# EasyEDA schematic SCH_leanRA_2024-04-03.json
TITLE: Eletrônica Projeto Lean Realidade Aumentada; REV: 1.0; Date: 2023-11-07; Sheet: 1/1; Drawn By: renatobs; Company: SENAI Uberaba
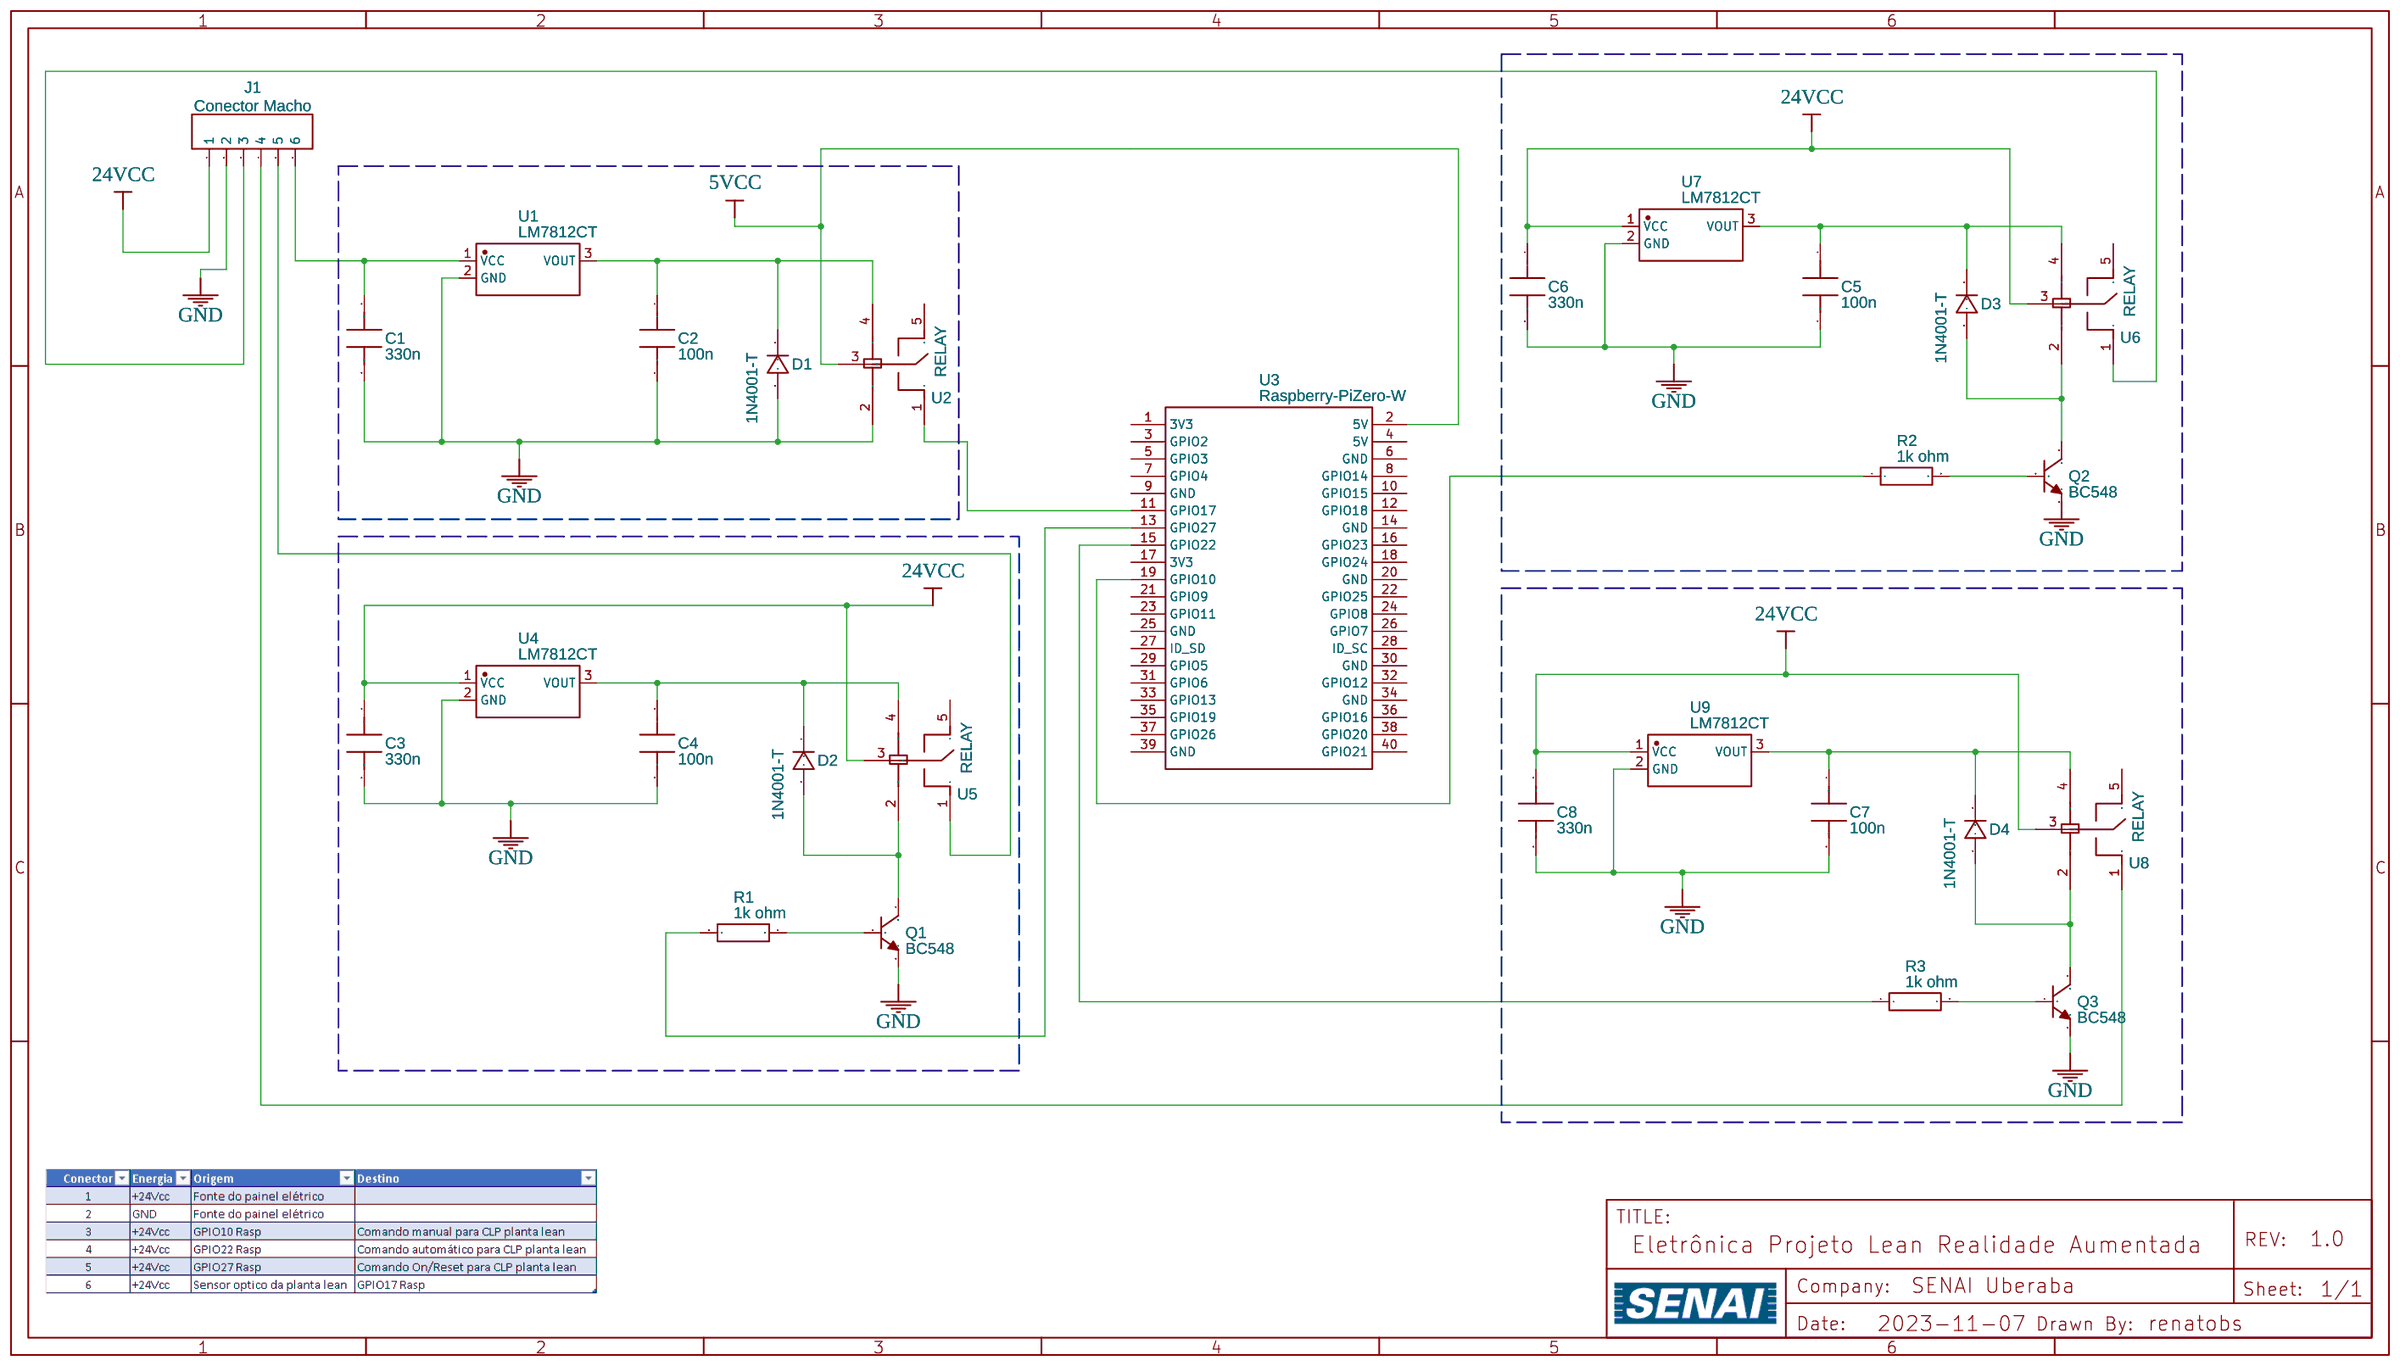
[diagram p0: schematic sheet]

## Parts
C1  330n  [DISC CAPACITOR]
C2  100n  [DISC CAPACITOR]
C3  330n  [DISC CAPACITOR]
C4  100n  [DISC CAPACITOR]
C5  100n  [DISC CAPACITOR]
C6  330n  [DISC CAPACITOR]
C7  100n  [DISC CAPACITOR]
C8  330n  [DISC CAPACITOR]
D1  1N4001-T  [DO-41_BD2.4-L4.7-P8.70-D0.9-RD]
D2  1N4001-T  [DO-41_BD2.4-L4.7-P8.70-D0.9-RD]
D3  1N4001-T  [DO-41_BD2.4-L4.7-P8.70-D0.9-RD]
D4  1N4001-T  [DO-41_BD2.4-L4.7-P8.70-D0.9-RD]
J1  Conector Macho  [HDR-M-2.54_1X6]
Q1  BC548  [BC548]
Q2  BC548  [BC548]
Q3  BC548  [BC548]
R1  1k ohm  [1/4 WATT RESISTOR 1/4]
R2  1k ohm  [1/4 WATT RESISTOR 1/4]
R3  1k ohm  [1/4 WATT RESISTOR 1/4]
U1  LM7812CT  [TO-220-3_L10.0-W4.6-P2.54-L]
U2  RELAY  [RELAY-TH_RELAY-SPST]
U3  Raspberry-PiZero-W  [RASPBERRY-PIZERO-W]
U4  LM7812CT  [TO-220-3_L10.0-W4.6-P2.54-L]
U5  RELAY  [RELAY-TH_RELAY-SPST]
U6  RELAY  [RELAY-TH_RELAY-SPST]
U7  LM7812CT  [TO-220-3_L10.0-W4.6-P2.54-L]
U8  RELAY  [RELAY-TH_RELAY-SPST]
U9  LM7812CT  [TO-220-3_L10.0-W4.6-P2.54-L]

## Library data of the parts
C1-C8 = DISC CAPACITOR COPY: Contributor: Suraj Prabhakaran
D1-D4 = 1N4001-T: Contributor: LCSC; Supplier: LCSC; Supplier Part: C99656; Manufacturer: DIODES(美台); JLCPCB Part Class: Extended Part; link: https://lcsc.com/eda_search?q=C99656&%26type=1&ref=editor
J1 = HDR-M-2.54_1x6: Supplier Part: C190819; Supplier: LCSC; Contributor: LCEDA_Lib
Q1-Q3 = BC548: Supplier: RICCADONNA LUCIANO; Manufacturer: Officine PADANE; Manufacturer Part: BC.548; Supplier Part: BC.548; JLCPCB Part Class: Extended Part; Contributor: paolonogara1972
R1-R3 = RESISTOR 1/4: Contributor: NIPUN GUPTA
U1 U4 U7 U9 = LM7812CT: Contributor: lcsc; Supplier: LCSC; Supplier Part: C7432223; Manufacturer: HGSEMI(华冠); link: https://lcsc.com/eda_search?q=C7432223&%26type=1&ref=editor
U2 U5 U6 U8 = RELAY-SPST: Contributor: LCSC; Supplier: LCSC; Supplier Part: C2941249; Manufacturer: null; Manufacturer Part: Relay-SPST; JLCPCB Part Class: Extended Part; link: https://lcsc.com/eda_search?q=C2941249&%26type=1&ref=editor
U3 = Raspberry-PiZero-W: Contributor: pcbnewbe66

## Nets
5VCC: U2.3 U3.2(5V)
24VCC: C3.1 C6.1 C8.1 J1.1 U4.1(VCC) U5.3 U6.3 U7.1(VCC) U8.3 U9.1(VCC)
GND: C1.2 C2.2 C3.2 C4.2 C5.2 C6.2 C7.2 C8.2 D1.2(A) J1.2 Q1.3(E) Q2.3(E) Q3.3(E) U1.2(GND) U2.2 U4.2(GND) U7.2(GND) U9.2(GND)
Net-(C1-1): C1.1 J1.6 U1.1(VCC)
Net-(C2-1): C2.1 D1.1(C) U1.3(VOUT) U2.4
Net-(C4-1): C4.1 D2.1(C) U4.3(VOUT) U5.4
Net-(C5-1): C5.1 D3.1(C) U6.4 U7.3(VOUT)
Net-(C7-1): C7.1 D4.1(C) U8.4 U9.3(VOUT)
Net-(D2-2): D2.2(A) Q1.1(C) U5.2
Net-(D3-2): D3.2(A) Q2.1(C) U6.2
Net-(D4-2): D4.2(A) Q3.1(C) U8.2
Net-(J1-3): J1.3 U6.1
Net-(J1-4): J1.4 U8.1
Net-(J1-5): J1.5 U5.1
Net-(Q1-2): Q1.2(B) R1.2
Net-(Q2-2): Q2.2(B) R2.2
Net-(Q3-2): Q3.2(B) R3.2
Net-(R1-1): R1.1 U3.13(GPIO27)
Net-(R2-1): R2.1 U3.19(GPIO10)
Net-(R3-1): R3.1 U3.15(GPIO22)
Net-(U2-1): U2.1 U3.11(GPIO17)

Not connected (* = marked no-connect by the designer): U2 5; U3 1(3V3) 3(GPIO2) 4(5V) 5(GPIO3) 6(GND) 7(GPIO4) 8(GPIO14) 9(GND) 10(GPIO15) 12(GPIO18) 14(GND) 16(GPIO23) 17(3V3) 18(GPIO24) 20(GND) 21(GPIO9) 22(GPIO25) 23(GPIO11) 24(GPIO8) 25(GND) 26(GPIO7) 27(ID_SD) 28(ID_SC) 29(GPIO5) 30(GND) 31(GPIO6) 32(GPIO12) 33(GPIO13) 34(GND) 35(GPIO19) 36(GPIO16) 37(GPIO26) 38(GPIO20) 39(GND) 40(GPIO21); U5 5; U6 5; U8 5
